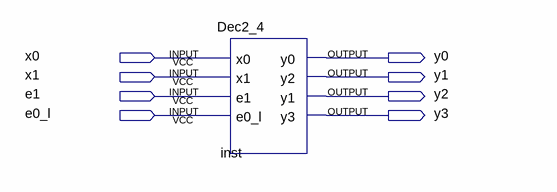
[diagram p0: schematic sheet]
// Quartus schematic DecoderDemo.bdf as structural Verilog: 1 symbols, 8 pins
module DecoderDemo (
  input  x0,
  input  x1,
  input  e1,
  input  e0_l,
  output y0,
  output y1,
  output y2,
  output y3
);

  Dec2_4 inst (.y0(y0), .y2(y1), .y1(y2), .y3(y3));  // open: x0, x1, e1, e0_l
endmodule
